# Altium project parallela12.PrjPcb
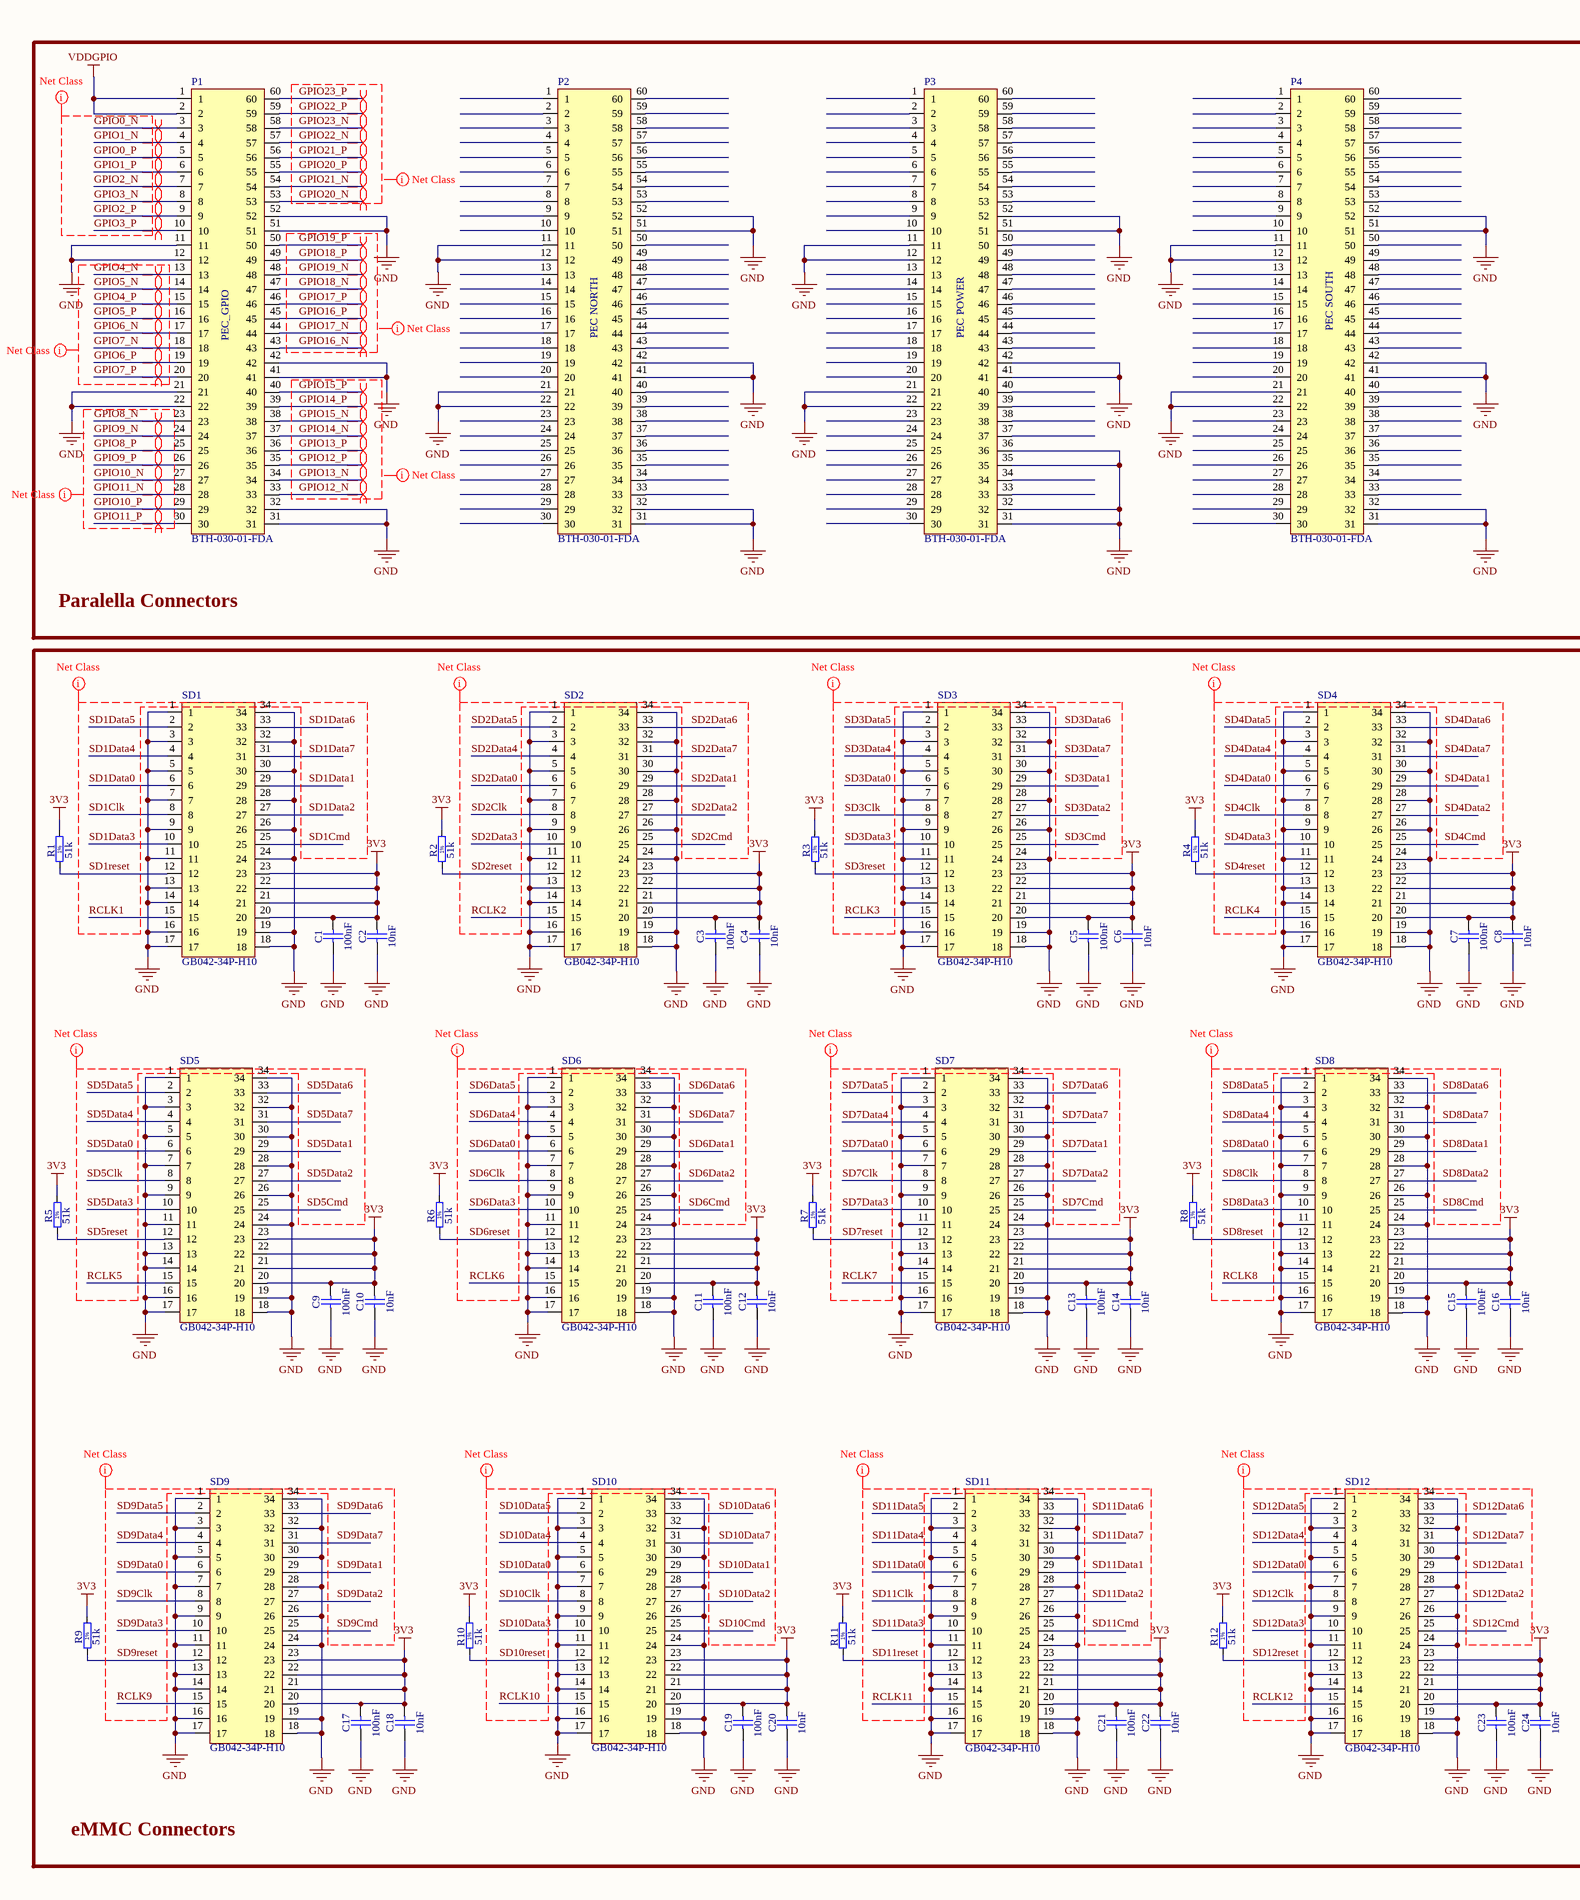
[diagram p0: Connectors.SchDoc, left]
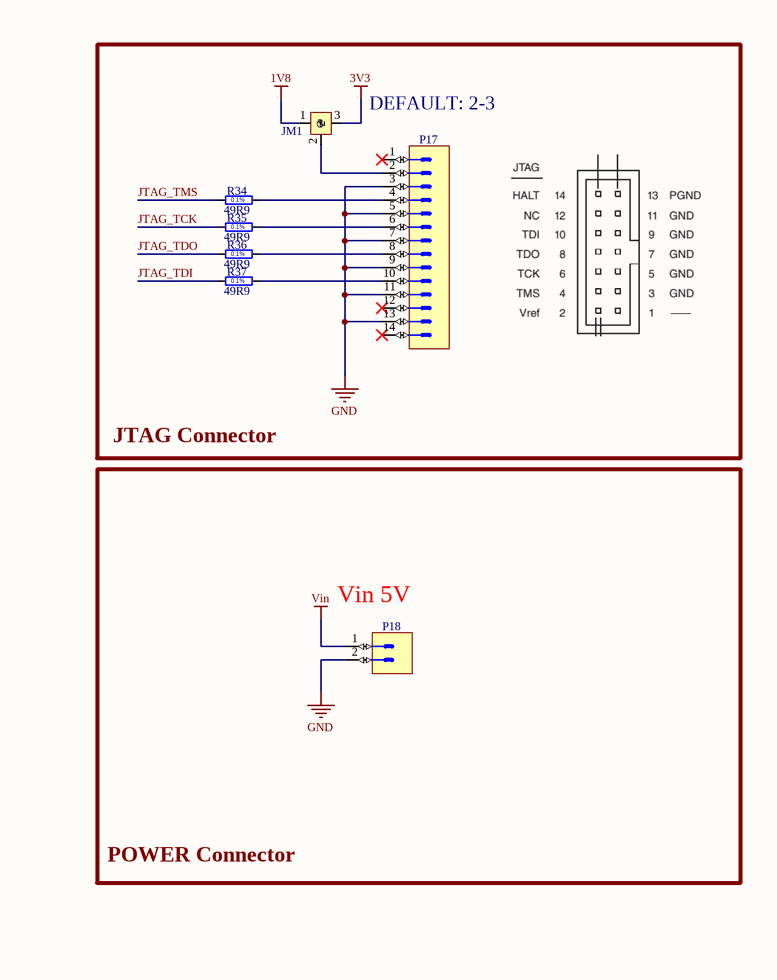
[diagram p1: Connectors.SchDoc, right]
1 sheet, 59 parts. Net scope: global (net labels, ports and power ports of the same name join across sheets).
Board file: PCB.PcbDoc

## Sheet Connectors.SchDoc
size A2

### Parts
C1  100nF  [CAPC1608X87N]
C2  10nF  [CAPC1608X87N]
C3  100nF  [CAPC1608X87N]
C4  10nF  [CAPC1608X87N]
C5  100nF  [CAPC1608X87N]
C6  10nF  [CAPC1608X87N]
C7  100nF  [CAPC1608X87N]
C8  10nF  [CAPC1608X87N]
C9  100nF  [CAPC1608X87N]
C10  10nF  [CAPC1608X87N]
C11  100nF  [CAPC1608X87N]
C12  10nF  [CAPC1608X87N]
C13  100nF  [CAPC1608X87N]
C14  10nF  [CAPC1608X87N]
C15  100nF  [CAPC1608X87N]
C16  10nF  [CAPC1608X87N]
C17  100nF  [CAPC1608X87N]
C18  10nF  [CAPC1608X87N]
C19  100nF  [CAPC1608X87N]
C20  10nF  [CAPC1608X87N]
C21  100nF  [CAPC1608X87N]
C22  10nF  [CAPC1608X87N]
C23  100nF  [CAPC1608X87N]
C24  10nF  [CAPC1608X87N]
JM1  Jumper 0R  [JUMPER_0R]  (value not drawn)
P1  BTH-030-01-FDA  [BTH-030-01-F-D-A]
P2  BTH-030-01-FDA  [BTH-030-01-F-D-A]
P3  BTH-030-01-FDA  [BTH-030-01-F-D-A]
P4  BTH-030-01-FDA  [BTH-030-01-F-D-A]
P17  (no value)
P18  KK®  [MOLEX_26-60-4020]  (value not drawn)
R1  51k  [RESC1608X55N]
R2  51k  [RESC1608X55N]
R3  51k  [RESC1608X55N]
R4  51k  [RESC1608X55N]
R5  51k  [RESC1608X55N]
R6  51k  [RESC1608X55N]
R7  51k  [RESC1608X55N]
R8  51k  [RESC1608X55N]
R9  51k  [RESC1608X55N]
R10  51k  [RESC1608X55N]
R11  51k  [RESC1608X55N]
R12  51k  [RESC1608X55N]
R34  49R9  [RESC1608X55N]
R35  49R9  [RESC1608X55N]
R36  49R9  [RESC1608X55N]
R37  49R9  [RESC1608X55N]
SD1  GB042-34P-H10  [GB042-34P-H10]
SD2  GB042-34P-H10  [GB042-34P-H10]
SD3  GB042-34P-H10  [GB042-34P-H10]
SD4  GB042-34P-H10  [GB042-34P-H10]
SD5  GB042-34P-H10  [GB042-34P-H10]
SD6  GB042-34P-H10  [GB042-34P-H10]
SD7  GB042-34P-H10  [GB042-34P-H10]
SD8  GB042-34P-H10  [GB042-34P-H10]
SD9  GB042-34P-H10  [GB042-34P-H10]
SD10  GB042-34P-H10  [GB042-34P-H10]
SD11  GB042-34P-H10  [GB042-34P-H10]
SD12  GB042-34P-H10  [GB042-34P-H10]

### Blocks framed on the sheet
Paralella Connectors: P1-P4
JTAG Connector: JM1 P17 R34-R37
Vin 5V: P18
eMMC Connectors: C1-C24 R1-R12 SD1-SD12

### Nets
1V8: JM1.1
3V3: C1.2 C2.2 C3.2 C4.2 C5.2 C6.2 C7.2 C8.2 C9.2 C10.2 C11.2 C12.2 C13.2 C14.2 C15.2 C16.2 C17.2 C18.2 C19.2 C20.2 C21.2 C22.2 C23.2 C24.2 JM1.3 R1.2 R2.2 R3.2 R4.2 R5.2 R6.2 R7.2 R8.2 R9.2 R10.2 R11.2 R12.2 SD1.20 SD1.21 SD1.22 SD1.23 SD2.20 SD2.21 SD2.22 SD2.23 SD3.20 SD3.21 SD3.22 SD3.23 SD4.20 SD4.21 SD4.22 SD4.23 SD5.20 SD5.21 SD5.22 SD5.23 SD6.20 SD6.21 SD6.22 SD6.23 SD7.20 SD7.21 SD7.22 SD7.23 SD8.20 SD8.21 SD8.22 SD8.23 SD9.20 SD9.21 SD9.22 SD9.23 SD10.20 SD10.21 SD10.22 SD10.23 SD11.20 SD11.21 SD11.22 SD11.23 SD12.20 SD12.21 SD12.22 SD12.23
GND: C1.1 C2.1 C3.1 C4.1 C5.1 C6.1 C7.1 C8.1 C9.1 C10.1 C11.1 C12.1 C13.1 C14.1 C15.1 C16.1 C17.1 C18.1 C19.1 C20.1 C21.1 C22.1 C23.1 C24.1 P1.11 P1.12 P1.21 P1.22 P1.31 P1.32 P1.41 P1.42 P1.51 P1.52 P2.11 P2.12 P2.21 P2.22 P2.31 P2.32 P2.41 P2.42 P2.51 P2.52 P3.11 P3.12 P3.21 P3.22 P3.31 P3.32 P3.35 P3.36 P3.41 P3.42 P3.51 P3.52 P4.11 P4.12 P4.21 P4.22 P4.31 P4.32 P4.41 P4.42 P4.51 P4.52 P17.3 P17.5 P17.7 P17.9 P17.11 P17.13 P18.2 SD1.1 SD1.3 SD1.5 SD1.7 SD1.9 SD1.11 SD1.13 SD1.14 SD1.16 SD1.17 SD1.18 SD1.19 SD1.24 SD1.26 SD1.28 SD1.30 SD1.32 SD1.34 SD2.1 SD2.3 SD2.5 SD2.7 SD2.9 SD2.11 SD2.13 SD2.14 SD2.16 SD2.17 SD2.18 SD2.19 SD2.24 SD2.26 SD2.28 SD2.30 SD2.32 SD2.34 SD3.1 SD3.3 SD3.5 SD3.7 SD3.9 SD3.11 SD3.13 SD3.14 SD3.16 SD3.17 SD3.18 SD3.19 SD3.24 SD3.26 SD3.28 SD3.30 SD3.32 SD3.34 SD4.1 SD4.3 SD4.5 SD4.7 SD4.9 SD4.11 SD4.13 SD4.14 SD4.16 SD4.17 SD4.18 SD4.19 SD4.24 SD4.26 SD4.28 SD4.30 SD4.32 SD4.34 SD5.1 SD5.3 SD5.5 SD5.7 SD5.9 SD5.11 SD5.13 SD5.14 SD5.16 SD5.17 SD5.18 SD5.19 SD5.24 SD5.26 SD5.28 SD5.30 SD5.32 SD5.34 SD6.1 SD6.3 SD6.5 SD6.7 SD6.9 SD6.11 SD6.13 SD6.14 SD6.16 SD6.17 SD6.18 SD6.19 SD6.24 SD6.26 SD6.28 SD6.30 SD6.32 SD6.34 SD7.1 SD7.3 SD7.5 SD7.7 SD7.9 SD7.11 SD7.13 SD7.14 SD7.16 SD7.17 SD7.18 SD7.19 SD7.24 SD7.26 SD7.28 SD7.30 SD7.32 SD7.34 SD8.1 SD8.3 SD8.5 SD8.7 SD8.9 SD8.11 SD8.13 SD8.14 SD8.16 SD8.17 SD8.18 SD8.19 SD8.24 SD8.26 SD8.28 SD8.30 SD8.32 SD8.34 SD9.1 SD9.3 SD9.5 SD9.7 SD9.9 SD9.11 SD9.13 SD9.14 SD9.16 SD9.17 SD9.18 SD9.19 SD9.24 SD9.26 SD9.28 SD9.30 SD9.32 SD9.34 SD10.1 SD10.3 SD10.5 SD10.7 SD10.9 SD10.11 SD10.13 SD10.14 SD10.16 SD10.17 SD10.18 SD10.19 SD10.24 SD10.26 SD10.28 SD10.30 SD10.32 SD10.34 SD11.1 SD11.3 SD11.5 SD11.7 SD11.9 SD11.11 SD11.13 SD11.14 SD11.16 SD11.17 SD11.18 SD11.19 SD11.24 SD11.26 SD11.28 SD11.30 SD11.32 SD11.34 SD12.1 SD12.3 SD12.5 SD12.7 SD12.9 SD12.11 SD12.13 SD12.14 SD12.16 SD12.17 SD12.18 SD12.19 SD12.24 SD12.26 SD12.28 SD12.30 SD12.32 SD12.34
VDDGPIO: P1.1 P1.2
Vin: P18.1
GPIO0_N: P1.3
GPIO0_P: P1.5
GPIO1_N: P1.4
GPIO1_P: P1.6
GPIO2_N: P1.7
GPIO2_P: P1.9
GPIO3_N: P1.8
GPIO3_P: P1.10
GPIO4_N: P1.13
GPIO4_P: P1.15
GPIO5_N: P1.14
GPIO5_P: P1.16
GPIO6_N: P1.17
GPIO6_P: P1.19
GPIO7_N: P1.18
GPIO7_P: P1.20
GPIO8_N: P1.23
GPIO8_P: P1.25
GPIO9_N: P1.24
GPIO9_P: P1.26
GPIO10_N: P1.27
GPIO10_P: P1.29
GPIO11_N: P1.28
GPIO11_P: P1.30
GPIO12_N: P1.33
GPIO12_P: P1.35
GPIO13_N: P1.34
GPIO13_P: P1.36
GPIO14_N: P1.37
GPIO14_P: P1.39
GPIO15_N: P1.38
GPIO15_P: P1.40
GPIO16_N: P1.43
GPIO16_P: P1.45
GPIO17_N: P1.44
GPIO17_P: P1.46
GPIO18_N: P1.47
GPIO18_P: P1.49
GPIO19_N: P1.48
GPIO19_P: P1.50
GPIO20_N: P1.53
GPIO20_P: P1.55
GPIO21_N: P1.54
GPIO21_P: P1.56
GPIO22_N: P1.57
GPIO22_P: P1.59
GPIO23_N: P1.58
GPIO23_P: P1.60
JTAG_TCK: R35.1
JTAG_TDI: R37.1
JTAG_TDO: R36.1
JTAG_TMS: R34.1
RCLK1: SD1.15
RCLK2: SD2.15
RCLK3: SD3.15
RCLK4: SD4.15
RCLK5: SD5.15
RCLK6: SD6.15
RCLK7: SD7.15
RCLK8: SD8.15
RCLK9: SD9.15
RCLK10: SD10.15
RCLK11: SD11.15
RCLK12: SD12.15
SD1Clk: SD1.8
SD1Cmd: SD1.25
SD1Data0: SD1.6
SD1Data1: SD1.29
SD1Data2: SD1.27
SD1Data3: SD1.10
SD1Data4: SD1.4
SD1Data5: SD1.2
SD1Data6: SD1.33
SD1Data7: SD1.31
SD1reset: R1.1 SD1.12
SD2Clk: SD2.8
SD2Cmd: SD2.25
SD2Data0: SD2.6
SD2Data1: SD2.29
SD2Data2: SD2.27
SD2Data3: SD2.10
SD2Data4: SD2.4
SD2Data5: SD2.2
SD2Data6: SD2.33
SD2Data7: SD2.31
SD2reset: R2.1 SD2.12
SD3Clk: SD3.8
SD3Cmd: SD3.25
SD3Data0: SD3.6
SD3Data1: SD3.29
SD3Data2: SD3.27
SD3Data3: SD3.10
SD3Data4: SD3.4
SD3Data5: SD3.2
SD3Data6: SD3.33
SD3Data7: SD3.31
SD3reset: R3.1 SD3.12
SD4Clk: SD4.8
SD4Cmd: SD4.25
SD4Data0: SD4.6
SD4Data1: SD4.29
SD4Data2: SD4.27
SD4Data3: SD4.10
SD4Data4: SD4.4
SD4Data5: SD4.2
SD4Data6: SD4.33
SD4Data7: SD4.31
SD4reset: R4.1 SD4.12
SD5Clk: SD5.8
SD5Cmd: SD5.25
SD5Data0: SD5.6
SD5Data1: SD5.29
SD5Data2: SD5.27
SD5Data3: SD5.10
SD5Data4: SD5.4
SD5Data5: SD5.2
SD5Data6: SD5.33
SD5Data7: SD5.31
SD5reset: R5.1 SD5.12
SD6Clk: SD6.8
SD6Cmd: SD6.25
SD6Data0: SD6.6
SD6Data1: SD6.29
SD6Data2: SD6.27
SD6Data3: SD6.10
SD6Data4: SD6.4
SD6Data5: SD6.2
SD6Data6: SD6.33
SD6Data7: SD6.31
SD6reset: R6.1 SD6.12
SD7Clk: SD7.8
SD7Cmd: SD7.25
SD7Data0: SD7.6
SD7Data1: SD7.29
SD7Data2: SD7.27
SD7Data3: SD7.10
SD7Data4: SD7.4
SD7Data5: SD7.2
SD7Data6: SD7.33
SD7Data7: SD7.31
SD7reset: R7.1 SD7.12
SD8Clk: SD8.8
SD8Cmd: SD8.25
SD8Data0: SD8.6
SD8Data1: SD8.29
SD8Data2: SD8.27
SD8Data3: SD8.10
SD8Data4: SD8.4
SD8Data5: SD8.2
SD8Data6: SD8.33
SD8Data7: SD8.31
SD8reset: R8.1 SD8.12
SD9Clk: SD9.8
SD9Cmd: SD9.25
SD9Data0: SD9.6
SD9Data1: SD9.29
SD9Data2: SD9.27
SD9Data3: SD9.10
SD9Data4: SD9.4
SD9Data5: SD9.2
SD9Data6: SD9.33
SD9Data7: SD9.31
SD9reset: R9.1 SD9.12
SD10Clk: SD10.8
SD10Cmd: SD10.25
SD10Data0: SD10.6
SD10Data1: SD10.29
SD10Data2: SD10.27
SD10Data3: SD10.10
SD10Data4: SD10.4
SD10Data5: SD10.2
SD10Data6: SD10.33
SD10Data7: SD10.31
SD10reset: R10.1 SD10.12
SD11Clk: SD11.8
SD11Cmd: SD11.25
SD11Data0: SD11.6
SD11Data1: SD11.29
SD11Data2: SD11.27
SD11Data3: SD11.10
SD11Data4: SD11.4
SD11Data5: SD11.2
SD11Data6: SD11.33
SD11Data7: SD11.31
SD11reset: R11.1 SD11.12
SD12Clk: SD12.8
SD12Cmd: SD12.25
SD12Data0: SD12.6
SD12Data1: SD12.29
SD12Data2: SD12.27
SD12Data3: SD12.10
SD12Data4: SD12.4
SD12Data5: SD12.2
SD12Data6: SD12.33
SD12Data7: SD12.31
SD12reset: R12.1 SD12.12
NetJM1_2: JM1.2 P17.2
NetP17_4: P17.4 R34.2
NetP17_6: P17.6 R35.2
NetP17_8: P17.8 R36.2
NetP17_10: P17.10 R37.2

Not connected (* = marked no-connect by the designer): P1 HOLE; P2 1 2 3 4 5 6 7 8 9 10 13 14 15 16 17 18 19 20 23 24 25 26 27 28 29 30 33 34 35 36 37 38 39 40 43 44 45 46 47 48 49 50 53 54 55 56 57 58 59 60 HOLE; P3 1 2 3 4 5 6 7 8 9 10 13 14 15 16 17 18 19 20 23 24 25 26 27 28 29 30 33 34 37 38 39 40 43 44 45 46 47 48 49 50 53 54 55 56 57 58 59 60 HOLE; P4 1 2 3 4 5 6 7 8 9 10 13 14 15 16 17 18 19 20 23 24 25 26 27 28 29 30 33 34 35 36 37 38 39 40 43 44 45 46 47 48 49 50 53 54 55 56 57 58 59 60 HOLE; P17 1* 12* 14* HOLE

### Layout directives
differential pair: GPIO0_N, GPIO0_P, GPIO1_N, GPIO1_P, GPIO2_N, GPIO2_P, GPIO3_N, GPIO3_P, GPIO4_N, GPIO4_P, GPIO5_N, GPIO5_P, GPIO6_N, GPIO6_P, GPIO7_N, GPIO7_P, GPIO8_N, GPIO8_P, GPIO9_N, GPIO9_P, GPIO10_N, GPIO10_P, GPIO11_N, GPIO11_P, GPIO12_N, GPIO12_P, GPIO13_N, GPIO13_P, GPIO14_N, GPIO14_P, GPIO15_N, GPIO15_P, GPIO16_N, GPIO16_P, GPIO17_N, GPIO17_P, GPIO18_N, GPIO18_P, GPIO19_N, GPIO19_P, GPIO20_N, GPIO20_P, GPIO21_N, GPIO21_P, GPIO22_N, GPIO22_P, GPIO23_N, GPIO23_P
net class SD1: RCLK1, SD1Clk, SD1Cmd, SD1Data0, SD1Data1, SD1Data2, SD1Data3, SD1Data4, SD1Data5, SD1Data6, SD1Data7, SD1reset
net class SD2: RCLK2, SD2Clk, SD2Cmd, SD2Data0, SD2Data1, SD2Data2, SD2Data3, SD2Data4, SD2Data5, SD2Data6, SD2Data7, SD2reset
net class SD3: RCLK3, SD3Clk, SD3Cmd, SD3Data0, SD3Data1, SD3Data2, SD3Data3, SD3Data4, SD3Data5, SD3Data6, SD3Data7, SD3reset
net class SD4: RCLK4, SD4Clk, SD4Cmd, SD4Data0, SD4Data1, SD4Data2, SD4Data3, SD4Data4, SD4Data5, SD4Data6, SD4Data7, SD4reset
net class SD5: RCLK5, SD5Clk, SD5Cmd, SD5Data0, SD5Data1, SD5Data2, SD5Data3, SD5Data4, SD5Data5, SD5Data6, SD5Data7, SD5reset
net class SD6: RCLK6, SD6Clk, SD6Cmd, SD6Data0, SD6Data1, SD6Data2, SD6Data3, SD6Data4, SD6Data5, SD6Data6, SD6Data7, SD6reset
net class SD7: RCLK7, SD7Clk, SD7Cmd, SD7Data0, SD7Data1, SD7Data2, SD7Data3, SD7Data4, SD7Data5, SD7Data6, SD7Data7, SD7reset
net class SD8: RCLK8, SD8Clk, SD8Cmd, SD8Data0, SD8Data1, SD8Data2, SD8Data3, SD8Data4, SD8Data5, SD8Data6, SD8Data7, SD8reset
net class SD9: RCLK9, SD9Clk, SD9Cmd, SD9Data0, SD9Data1, SD9Data2, SD9Data3, SD9Data4, SD9Data5, SD9Data6, SD9Data7, SD9reset
net class SD10: RCLK10, SD10Clk, SD10Cmd, SD10Data0, SD10Data1, SD10Data2, SD10Data3, SD10Data4, SD10Data5, SD10Data6, SD10Data7, SD10reset
net class SD11: RCLK11, SD11Clk, SD11Cmd, SD11Data0, SD11Data1, SD11Data2, SD11Data3, SD11Data4, SD11Data5, SD11Data6, SD11Data7, SD11reset
net class SD12: RCLK12, SD12Clk, SD12Cmd, SD12Data0, SD12Data1, SD12Data2, SD12Data3, SD12Data4, SD12Data5, SD12Data6, SD12Data7, SD12reset
net class GPIO: (no net found under the mark), GPIO0_N, GPIO0_P, GPIO1_N, GPIO1_P, GPIO2_N, GPIO2_P, GPIO3_N, GPIO3_P, GPIO4_N, GPIO4_P, GPIO5_N, GPIO5_P, GPIO6_N, GPIO6_P, GPIO7_N, GPIO7_P, GPIO8_N, GPIO8_P, GPIO9_N, GPIO9_P, GPIO10_N, GPIO10_P, GPIO11_N, GPIO11_P

### Notes on the sheet
- DEFAULT: 2-3
- (near P1) PEC_GPIO
- (near P2) PEC NORTH
- (near P3) PEC POWER
- (near P4) PEC SOUTH
- POWER Connector
- Title
- Size:
- Date:
- File:
- A2
- Number:
- Time:
- Revision:
- Sheet
- of
- (in symbol R0603_49R9_0.1%_0.063W_10PPM) 0.1%
- (in symbol R0603_51K_1%_0.1W_100PPM) 1%

### Library data of the parts
C1 C3 C5 C7 C9 C11 C13 C15 C17 C19 C21 C23 = CC0603_100NF_50V_10%_X7R: Non-polarised capacitor; Part Description: SMD Multilayer Chip Ceramic Capacitor; Manufacturer: GENERIC; Manufacturer1 Part Number: 223858615649; Voltage: 50V; TC: X7R; Tolerance: ±10%; Table: Capacitors SMD; Part Number: CC0603_100NF_50V_10%_X7R; Component Kind: Standard; Component Type: Standard; Pin Count: 2; Value: 100nF; Status: Preferred; Manufacturer Part Number: CC0603_100NF_50V_10%_X7R; Case: 0603; Mounted: Yes; Socket: No; SMD: Yes; Manufacturer1 Example: PHYCOMP; Manufacturer1 ComponentHeight: 0.87mm; HelpURL: \\cern.ch\dfs\Applications\Altium\Datasheets\CC0603_X7R_PHYCOMP.pdf; Author: CERN DEM JLC; CreateDate: 3.12.2007; LatestRevisionDate: 3.12.2007
C2 C4 C6 C8 C10 C12 C14 C16 C18 C20 C22 C24 = CC0603_10NF_50V_10%_X7R: Non-polarised capacitor; Part Description: SMD Multilayer Chip Ceramic Capacitor; Manufacturer: GENERIC; Manufacturer1 Part Number: 223858615636; Voltage: 50V; TC: X7R; Tolerance: ±10%; Table: Capacitors SMD; Part Number: CC0603_10NF_50V_10%_X7R; Component Kind: Standard; Component Type: Standard; Pin Count: 2; Value: 10nF; Status: Preferred; Manufacturer Part Number: CC0603_10NF_50V_10%_X7R; Case: 0603; Mounted: Yes; Socket: No; SMD: Yes; Manufacturer1 Example: PHYCOMP; Manufacturer1 ComponentHeight: 0.87mm; HelpURL: \\cern.ch\dfs\Applications\Altium\Datasheets\CC0603_X7R_PHYCOMP.pdf; Author: CERN DEM JLC; CreateDate: 3.12.2007; LatestRevisionDate: 3.12.2007
P1-P4 = BTH-030-01-FDA: Connector Parallela
P17 = Connector 14 Male: Manufacturer Part Number: 0878321420; Manufacturer: Molex, LLC; Description: CONN HEADER 14POS 2MM VERT SMD; Connector Type: Header, Shrouded; Number of Positions: 14; Number of Positions Loaded: All; Pitch: 0.079" (2.00mm); Category: Connectors, Interconnects; Supplier Part Number: WM18641-ND; Supplier: Digi-Key; RoHS: RoHS Compliant; Packaging: Tube; Contact Type: Male Pin; Number of Rows: 2; Row Spacing: 0.079" (2.00mm); Contact Mating Length: 0.141" (3.60mm); Mounting Type: Surface Mount; Termination: Solder; Fastening Type: -; Features: Board Guide; Contact Finish: Gold; Contact Finish Thickness: 15µin (0.38µm); Color: Black
P18 = MOLEX_26-60-4020: Connector 2 Male; Part Description: 3.96mm (.156") Pitch KK® Solid Header, Vertical, Friction Lock, 2 Circuits, Tin (Sn) Plating; Manufacturer: Molex, LLC; Manufacturer Part Number: 0026604020; Table: MOLEX; Number of Positions: 2; Connector Type: Header, Unshrouded; Pitch: 0.156" (3.96mm); Number of Positions Loaded: All; Description: CONN HEADER 2POS .156 VERT TIN; Part Number: MOLEX_26-60-4020; Component Kind: Standard; Component Type: Standard; Pin Count: 2; Family: KK®; Mounted: Yes; Socket: No; SMD: No; Status: None; ComponentHeight: 14.73mm; HelpURL: \\cern.ch\dfs\Applications\Altium\Datasheets\MOLEX_26-60-4020.pdf; Author: CERN DEM JLC; CreateDate: 6.04.2011; LatestRevisionDate: 6.04.2011; Contact Mating Length: 0.450" (11.43mm); Termination: Solder; Fastening Type: Friction Lock; Supplier Part Number: WM4620-ND; Contact Finish Thickness: 60µin (1.52µm); Mounting Type: Through Hole; Contact Type: Male Pin; Row Spacing: -; Supplier: Digi-Key; Contact Finish: Tin; Number of Rows: 1; RoHS: RoHS Compliant; Packaging: Bulk; Category: Connectors, Interconnects; Features: -; Color: Natural
R1-R12 = R0603_51K_1%_0.1W_100PPM: Resistor - 1%; Part Description: General Purpose Thick Film Chip Resistor; Manufacturer: GENERIC; Manufacturer1 Part Number: NRC06F5102TRF; Power: 0.1W; TC: ±100ppm/°C; Table: Resistors SMD; Part Number: R0603_51K_1%_0.1W_100PPM; Component Kind: Standard; Component Type: Standard; Pin Count: 2; Value: 51k; Status: Preferred; Tolerance: ±1%; Manufacturer Part Number: R0603_51K_1%_0.1W_100PPM; Case: 0603; Mounted: Yes; Socket: No; SMD: Yes; Manufacturer1 Example: NIC COMPONENT; Manufacturer1 ComponentHeight: 0.55mm; HelpURL: \\cern.ch\dfs\Applications\Altium\Datasheets\R0603_NIC_NRC.pdf; Author: CERN DEM JLC; CreateDate: 3.12.2007; LatestRevisionDate: 13.03.2008
R34-R37 = R0603_49R9_0.1%_0.063W_10PPM: Resistor - 0.1%; Part Description: Thin Film Chip Resistor; Manufacturer: GENERIC; Manufacturer1 Part Number: RN73C1J49R9BTDF; Power: 0.063W; TC: ±10ppm; Table: Resistors SMD; Part Number: R0603_49R9_0.1%_0.063W_10PPM; Component Kind: Standard; Component Type: Standard; Pin Count: 2; Value: 49R9; Status: Not recommended; Tolerance: ±0.1%; Manufacturer Part Number: R0603_49R9_0.1%_0.063W_10PPM; Case: 0603; Mounted: Yes; Socket: No; SMD: Yes; Manufacturer1 Example: TYCO HOLSWORTHY; Manufacturer1 ComponentHeight: 0.5mm; HelpURL: \\cern.ch\dfs\Applications\Altium\Datasheets\R0603_Tyco_RN73.pdf; Author: CERN DEM JLC; CreateDate: 3.12.2007; LatestRevisionDate: 13.03.2008
SD1-SD12 = GB042-34P-H10: Connector, eMMC